# EAGLE schematic v002 (EAGLE 6.4)

## Sheet 1 of 2
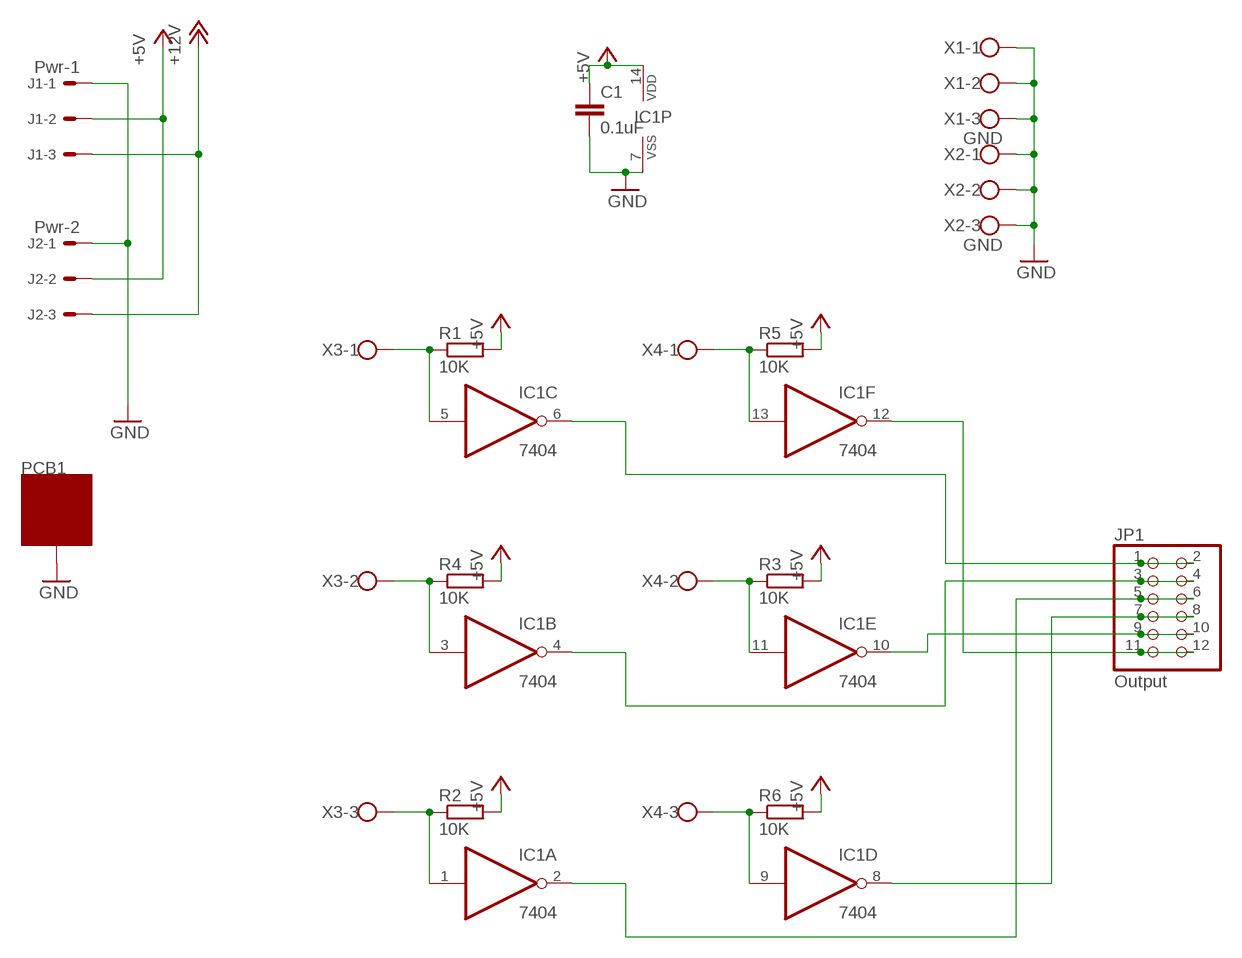
[diagram p0: schematic, sheet 1]

### Parts
C1  0.1uF  C-EU050-024X044  [C050-024X044]
IC1  7404  4584N  [DIL14]
J1  Pwr-1  22-27-2031-03  [6410-03]
J2  Pwr-2  22-27-2031-03  [6410-03]
JP1  Output  PINHD-2X6  [2X06]
PCB1  ZZZ_MODULE05X05  [ZZZ_MODULE_05X05]
R1  10K  R-EU_0207/2V  [0207/2V]
R2  10K  R-EU_0207/2V  [0207/2V]
R3  10K  R-EU_0207/2V  [0207/2V]
R4  10K  R-EU_0207/2V  [0207/2V]
R5  10K  R-EU_0207/2V  [0207/2V]
R6  10K  R-EU_0207/2V  [0207/2V]
X1  GND  W237-103  [W237-103]
X2  GND  W237-103  [W237-103]
X3  W237-103  [W237-103]
X4  W237-103  [W237-103]

### Nets
+5V: C1.1 IC1.14(P:VDD) J1.2 J2.2 R1.2 R2.2 R3.2 R4.2 R5.2 R6.2
+12V: J1.3 J2.3
GND: C1.2 IC1.7(P:VSS) J1.1 J2.1 PCB1.GND@1(GND) PCB1.GND@2(GND) PCB1.GND@3(GND) PCB1.GND@4(GND) PCB1.GND@5(GND) PCB1.GND@6(GND) PCB1.GND@7(GND) PCB1.GND@8(GND) X1.1 X1.2 X1.3 X2.1 X2.2 X2.3
N$1: IC1.2(A:O) JP1.5 JP1.6
N$2: IC1.1(A:I) R2.1 X3.3
N$3: IC1.6(C:O) JP1.1 JP1.2
N$4: IC1.5(C:I) R1.1 X3.1
N$6: IC1.11(E:I) R3.1 X4.2
N$7: IC1.10(E:O) JP1.9 JP1.10
N$8: IC1.3(B:I) R4.1 X3.2
N$9: IC1.12(F:O) JP1.11 JP1.12
N$10: IC1.13(F:I) R5.1 X4.1
N$11: IC1.8(D:O) JP1.7 JP1.8
N$12: IC1.9(D:I) R6.1 X4.3
N$13: IC1.4(B:O) JP1.3 JP1.4

## Sheet 2 of 2

## Library data of the parts
C1 = rcl:C-EU: CAPACITOR, European symbol
IC1 = 45xx:4584: Hex SCHMITT TRIGGER (74C14)
J1 J2 = con-molex:22-?-03: CONNECTOR wire to board 2.54 mm (.1 inch) pitch header; OC_FARNELL: unknown; OC_NEWARK: unknown
JP1 = pinhead:PINHD-2X6: PIN HEADER
PCB1 = GNLib:ZZZ_MODULE
R1-R6 = resistor:R-EU_: RESISTOR, European symbol
X1-X4 = con-wago-500:W237-103: WAGO SCREW CLAMP; MPN: 237-103; OC_FARNELL: unknown; OC_NEWARK: 18M7116